# Altium schematic sheet S01-INTERFACES.SchDoc
size B; SheetNumber: 2; SheetTotal: 4; BLOCK-TITLE: RADIO MODULE INTERFACES AND GPIO EXPANSION; BLOCK-SIZE: B; BLOCK-PROJECT: MULTIMOD RADIO MODULE; BLOCK-REVISION: 1; BLOCK-ORGANIZATION: UNIVERSITY OF FLORIDA; BLOCK-DESIGNER: MEHRON TALEBI; BLOCK-IDENTIFIER: SUMMER 2023; BLOCK-REVIEWER: MIKE STAPLETON
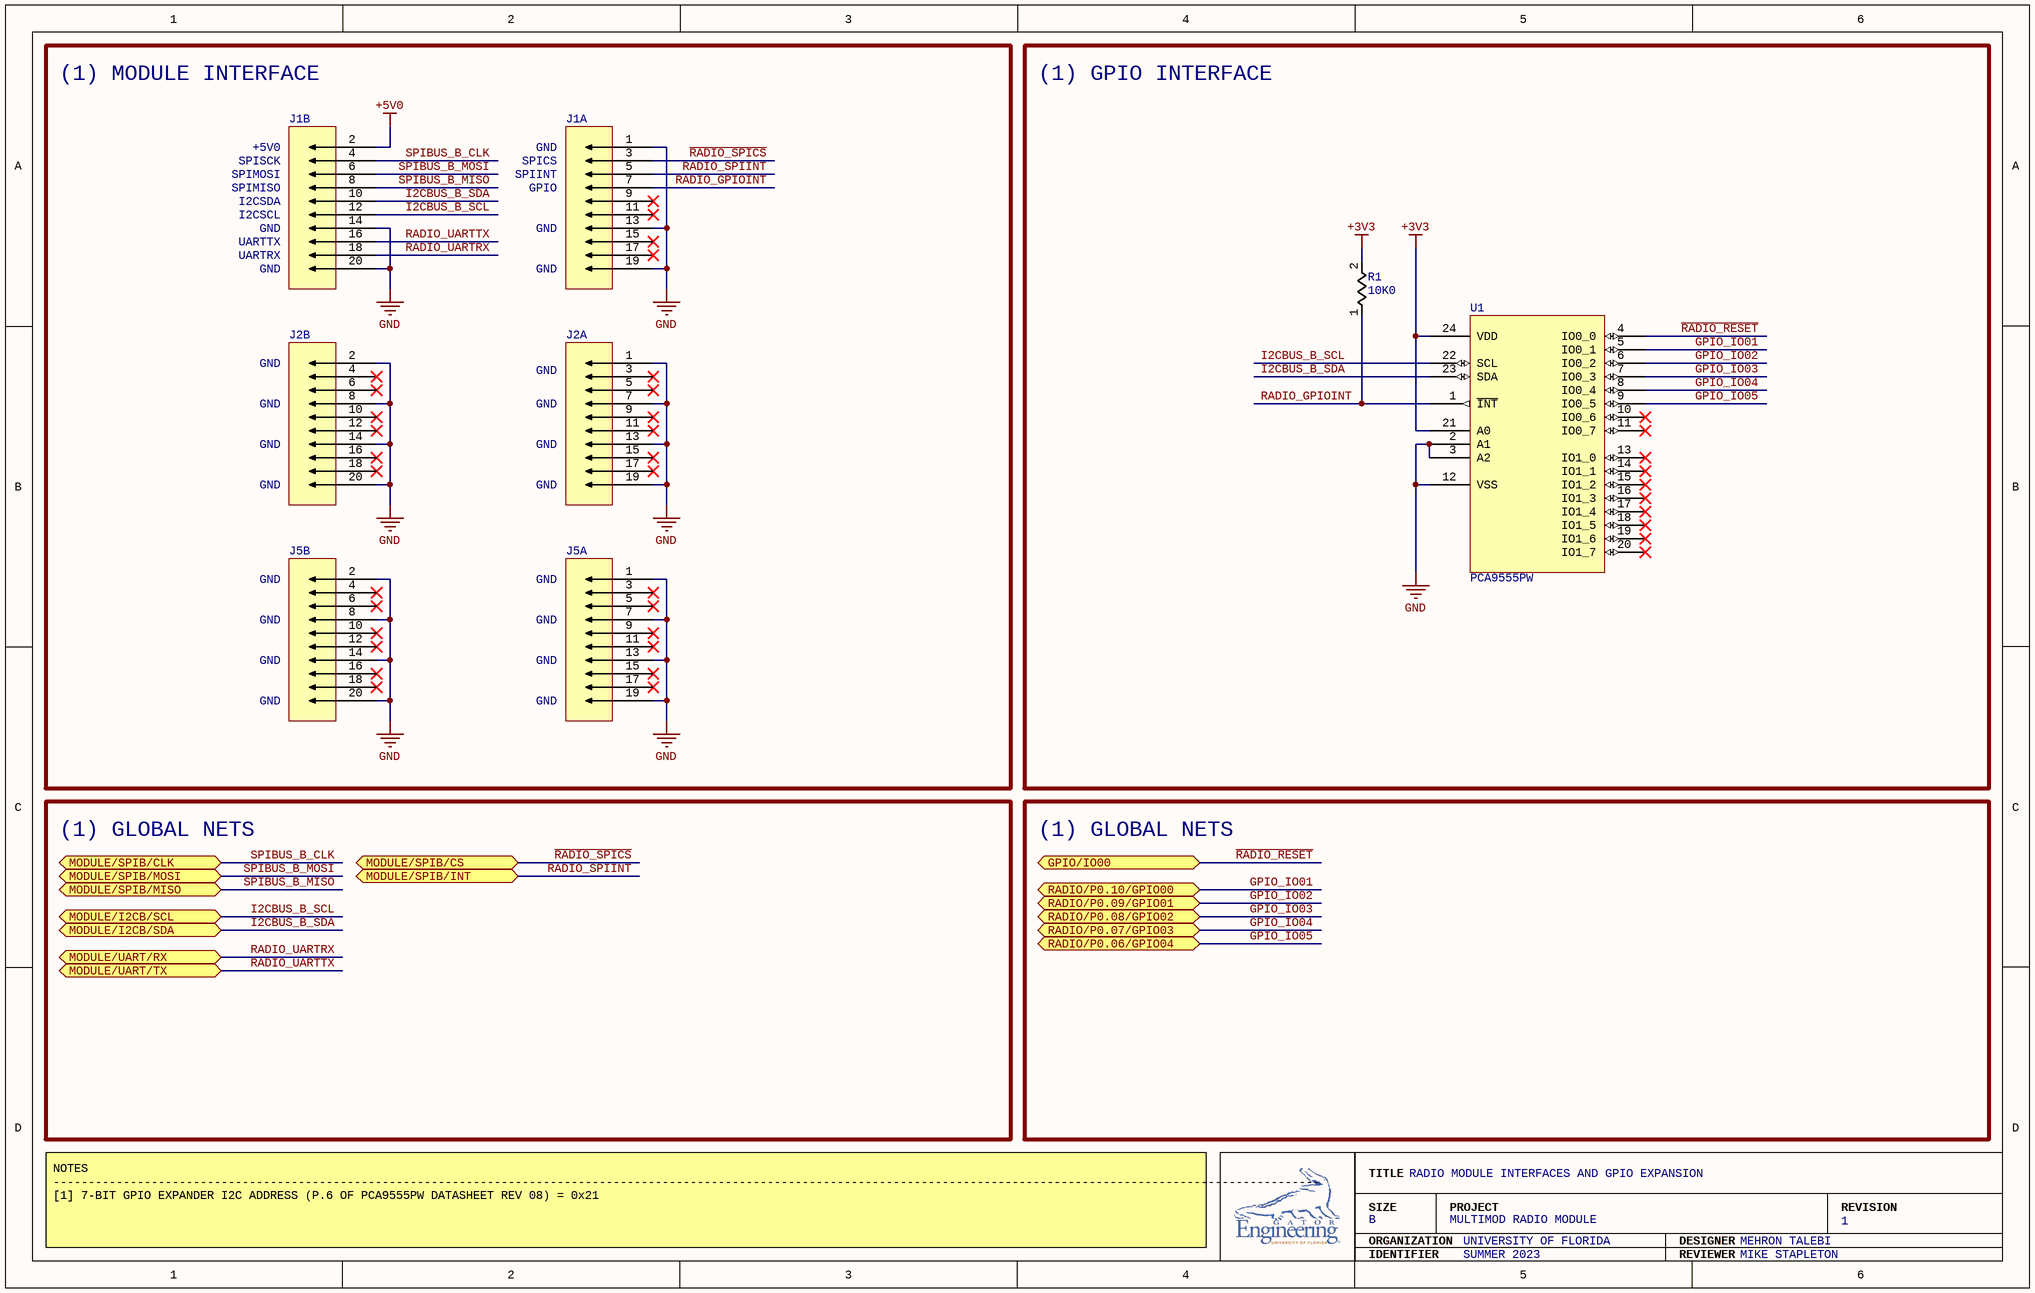
[diagram p0: S01-INTERFACES.SchDoc]

## Parts
J1  NPTC102KFMS-RC  [NPTC102KFMS-RC]  (value not drawn)  (parts A,B of 2)
J2  NPTC102KFMS-RC  [NPTC102KFMS-RC]  (value not drawn)  (parts A,B of 2)
J5  NPTC102KFMS-RC  [NPTC102KFMS-RC]  (value not drawn)  (parts A,B of 2)
R1  10K0  [RC0805FR-0710KL]
U1  PCA9555PW  [PCA9555PW]

## Blocks framed on the sheet
(1) MODULE INTERFACE: J1 J2 J5
(1) GPIO INTERFACE: R1 U1

## Ports
GPIO/IO00 (bidir), MODULE/I2CB/SCL (bidir), MODULE/I2CB/SDA (bidir), MODULE/SPIB/CLK (bidir), MODULE/SPIB/CS (bidir), MODULE/SPIB/INT (bidir), MODULE/SPIB/MISO (bidir), MODULE/SPIB/MOSI (bidir), MODULE/UART/RX (bidir), MODULE/UART/TX (bidir), RADIO/P0.06/GPIO04 (bidir), RADIO/P0.07/GPIO03 (bidir), RADIO/P0.08/GPIO02 (bidir), RADIO/P0.09/GPIO01 (bidir), RADIO/P0.10/GPIO00 (bidir)

## Nets
+3V3: R1.2 U1.21(A0) U1.24(VDD)
+5V0: J1.2
GND: J1.1 J1.13 J1.14 J1.19 J1.20 J2.1 J2.2 J2.7 J2.8 J2.13 J2.14 J2.19 J2.20 J5.1 J5.2 J5.7 J5.8 J5.13 J5.14 J5.19 J5.20 U1.2(A1) U1.3(A2) U1.12(VSS)
~{RADIO_RESET}: U1.4(IO0_0) ; port GPIO/IO00
~{RADIO_SPICS}: J1.3 ; port MODULE/SPIB/CS
GPIO_IO01: U1.5(IO0_1) ; port RADIO/P0.10/GPIO00
GPIO_IO02: U1.6(IO0_2) ; port RADIO/P0.09/GPIO01
GPIO_IO03: U1.7(IO0_3) ; port RADIO/P0.08/GPIO02
GPIO_IO04: U1.8(IO0_4) ; port RADIO/P0.07/GPIO03
GPIO_IO05: U1.9(IO0_5) ; port RADIO/P0.06/GPIO04
I2CBUS_B_SCL: J1.12 U1.22(SCL) ; port MODULE/I2CB/SCL
I2CBUS_B_SDA: J1.10 U1.23(SDA) ; port MODULE/I2CB/SDA
RADIO_GPIOINT: J1.7 R1.1 U1.1(~{INT})
RADIO_SPIINT: J1.5 ; port MODULE/SPIB/INT
RADIO_UARTRX: J1.18 ; port MODULE/UART/RX
RADIO_UARTTX: J1.16 ; port MODULE/UART/TX
SPIBUS_B_CLK: J1.4 ; port MODULE/SPIB/CLK
SPIBUS_B_MISO: J1.8 ; port MODULE/SPIB/MISO
SPIBUS_B_MOSI: J1.6 ; port MODULE/SPIB/MOSI

Not connected (* = marked no-connect by the designer): J1 9* 11* 15* 17*; J2 3* 4* 5* 6* 9* 10* 11* 12* 15* 16* 17* 18*; J5 3* 4* 5* 6* 9* 10* 11* 12* 15* 16* 17* 18*; U1 10(IO0_6)* 11(IO0_7)* 13(IO1_0)* 14(IO1_1)* 15(IO1_2)* 16(IO1_3)* 17(IO1_4)* 18(IO1_5)* 19(IO1_6)* 20(IO1_7)*

## Notes on the sheet
- +5V0
- SPISCK
- SPICS
- GND
- SPIMOSI
- SPIMISO
- I2CSCL
- I2CSDA
- UARTTX
- SPIINT
- GPIO
- UARTRX
- (1) GLOBAL NETS
- NOTES
  -------------------------------------------------------------------------------------------------------------------------------------------------------------------------------------
  [1] 7-BIT GPIO EXPANDER I2C ADDRESS (P.6 OF PCA9555PW DATASHEET REV 08) = 0x21
- TITLE
- SIZE
- ORGANIZATION
- PROJECT
- DESIGNER
- REVISION
- IDENTIFIER
- REVIEWER

## Library data of the parts
J1 J2 J5 = NPTC102KFMS-RC: CONN HDR 20POS 0.1 TIN SMD; Connector Type: Header; Style: Board to Board; Number of Positions: 20; Number of Positions Loaded: All; Pitch - Mating: 0.100" (2.54mm); Material Flammability Rating: UL94 V-0; Current Rating (Amps): 3A; Voltage Rating: 250V; System: Connector; Contact Type: Female Socket; Number of Rows: 2; Row Spacing - Mating: 0.100" (2.54mm); Mounting Type: Surface Mount; Termination: Solder; Fastening Type: Push-Pull; Contact Finish - Mating: Tin; Insulation Color: Black; Insulation Height: 0.299" (7.60mm); Operating Temperature: -40°C ~ 125°C; Contact Finish - Post: Tin; Insulation Material: Polyamide (PA6T), Nylon 6T; Contact Shape: Square; Contact Material: Phosphor Bronze; Supplier 1: Digi-Key; Supplier Part Number 1: S5680-ND
R1 = RC0805FR-0710KL: RES 10K OHM 1% 1/8W 0805; Resistance: 10 kOhms; Power (Watts): 0.125W, 1/8W; Temperature Coefficient: ±100ppm/°C; Tolerance: ±1%; Composition: Thick Film; Features: Moisture Resistant; Operating Temperature: -55°C ~ 155°C; Package / Case: 0805 (2012 Metric); Supplier Device Package: 0805; Size / Dimension: 0.079" L x 0.049" W (2.00mm x 1.25mm); Height - Seated (Max): 0.024" (0.60mm); Number of Terminations: 2; Supplier 1: Future Electronics; Supplier Part Number 1: 3310877
U1 = PCA9555PW: IC XPND 400KHZ I2C SMBUS 24TSSOP; Number of I/O: 16; Interface: I²C, SMBus; Interrupt Output: Yes; Output Type: Push-Pull; Current - Output Source/Sink: 10mA, 25mA; Voltage - Supply: 2.3V ~ 5.5V; Features: POR; Clock Frequency: 400 kHz; Operating Temperature: -40°C ~ 85°C; Mounting Type: Surface Mount; Package / Case: 24-TSSOP (0.173", 4.40mm Width); Supplier Device Package: 24-TSSOP; Supplier 1: Newark; Supplier Part Number 1: 24AC9600